# Altium schematic sheet -5V_generator.SchDoc: Wprowadź Tytuł
size A4; CheckedBy: Wprowadź sprawdzającego; CompanyName: Politechnika Warszawska; DrawnBy: Wprowadź autora; Organization: Koło Naukowe Robotyków; Address1: Nowowiejska 24; Address2: 00-001; Address3: Warszawa; Address4: Polska; Revision: V*.*; DrawnDate: 10.10.20; CheckDate: 10.10.20; ProjectName: Nazwa Projektu
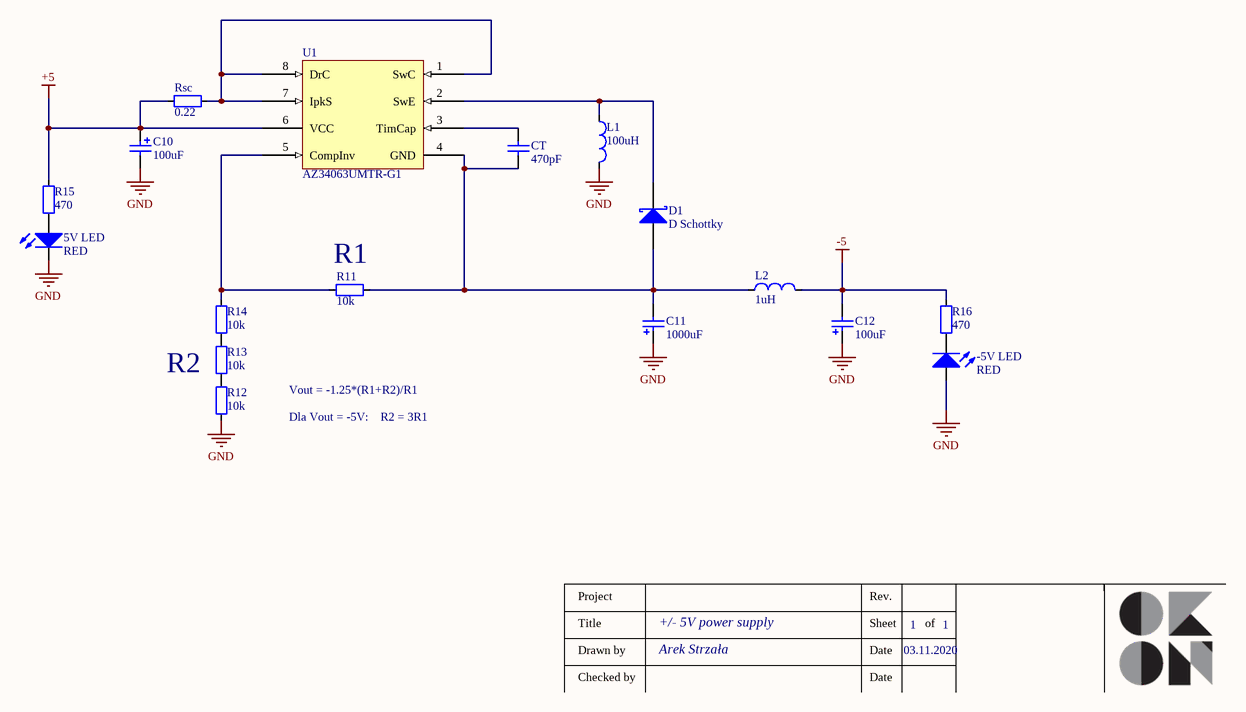
[diagram p0: -5V_generator.SchDoc]

## Parts
5V_LED  RED  [0805_led_yellow]
-5V_LED  RED  [0805_led_yellow]
C10  100uF  [Con_SMD_5x5.5]
C11  1000uF  [Con_SMD_5x5.5]
C12  100uF  [Con_SMD_5x5.5]
CT  value 470pF  [CAPC0603M]  (hidden comment: Cap)
D1  D Schottky  [SOD323F]
L1  100uH  [0805_IND]
L2  1uH  [0805_IND]
R11  10k  [RESC0603]
R12  10k  [RESC0603]
R13  10k  [RESC0603]
R14  10k  [RESC0603]
R15  470  [RESC0603]
R16  470  [RESC0603]
Rsc  0.22  [RESC0603]
U1  AZ34063UMTR-G1  [SOIC127P600X175-8N]

## Nets
+5: C10.1 R15.2 Rsc.1 U1.6(VCC)
-5: C12.2 L2.2 R16.2
GND: 5V_LED.2(K) -5V_LED.1(A) C10.2 C11.1 C12.1 L1.2 R12.1
Net5V_LED_1: 5V_LED.1(A) R15.1
Net-5V_LED_2: -5V_LED.2(K) R16.1
NetC11_2: C11.2 CT.2 D1.1(A) L2.1 R11.2 U1.4(GND)
NetCT_1: CT.1 U1.3(TimCap)
NetD1_2: D1.2(K) L1.1 U1.2(SwE)
NetR11_1: R11.1 R14.2 U1.5(CompInv)
NetR12_2: R12.2 R13.1
NetR13_2: R13.2 R14.1
NetRsc_2: Rsc.2 U1.1(SwC) U1.7(IpkS) U1.8(DrC)

## Notes on the sheet
- (near R11) R1
- R2
- Vout = -1.25*(R1+R2)/R1
- Dla Vout = -5V:    R2 = 3R1
- Project
- Rev.
- Title
- Drawn by
- Arek Strzała
- +/- 5V power supply
- Date
- Sheet
- 03.11.2020
- 1
- of
- Checked by

## Library data of the parts
5V_LED -5V_LED = LED: Light-emitting diode; COLOR: RED
C10-C12 = Cap_Pol: Polar capacitor
  C10 C12: Value: 100uF
  C11: Value: 1000uF
CT = Cap: Ceramic capacitor; Unit Price1: *; Unit Price2: *
D1 = D Schottky: Schottky Diode; Published: 8-Jun-2000; LatestRevisionDate: 17-Jul-2002; LatestRevisionNote: Re-released for DXP Platform.; PackageReference: SMB; Publisher: Altium Limited; PackageDescription: DO-214-AA/SMB; 2 C-Bend Leads; Body 5.3 x 3.6 mm, inc. leads (LxW); Code_JEDEC: DO-214-AA
L1 L2 = Inductor: Code_IEC: 1005; Value: 10uH; Published: 8-Jun-2000; LatestRevisionDate: 29-May-2009; LatestRevisionNote: IPC-7351 Footprint Added.; PackageReference: 0402-A; Publisher: Altium Limited; PackageDescription: Chip Inductor; Code_JEITA: 0402
R11-R16 Rsc = RES: Resistior
  R11-R14: Value: 10k
  R15 R16: Value: 470
  Rsc: Value: 0.22
U1 = AZ34063UMTR-G1: ComponentLink1Description: datasheet; ComponentLink1URL: https://www.tme.eu/Document/f583ca1a85dfa98789e5757031039545/AZ34063U.pdf; ComponentLink2Description: TME; ComponentLink2URL: https://www.tme.eu/pl/details/az34063umtr-g1/regulatory-napiecia-uklady-dc-dc/diodes-incorporated/